# EasyEDA Pro project 可调电源.eprj, schematic 控制板
Board Name: Board2; Create Date: 2025-12-11; Page Name: P1; Project Name: 可调电源; Schematic Name: 控制板; Update Date: 2025-12-27; Company: 嘉立创EDA; Page Size: A4; Version: V1.0
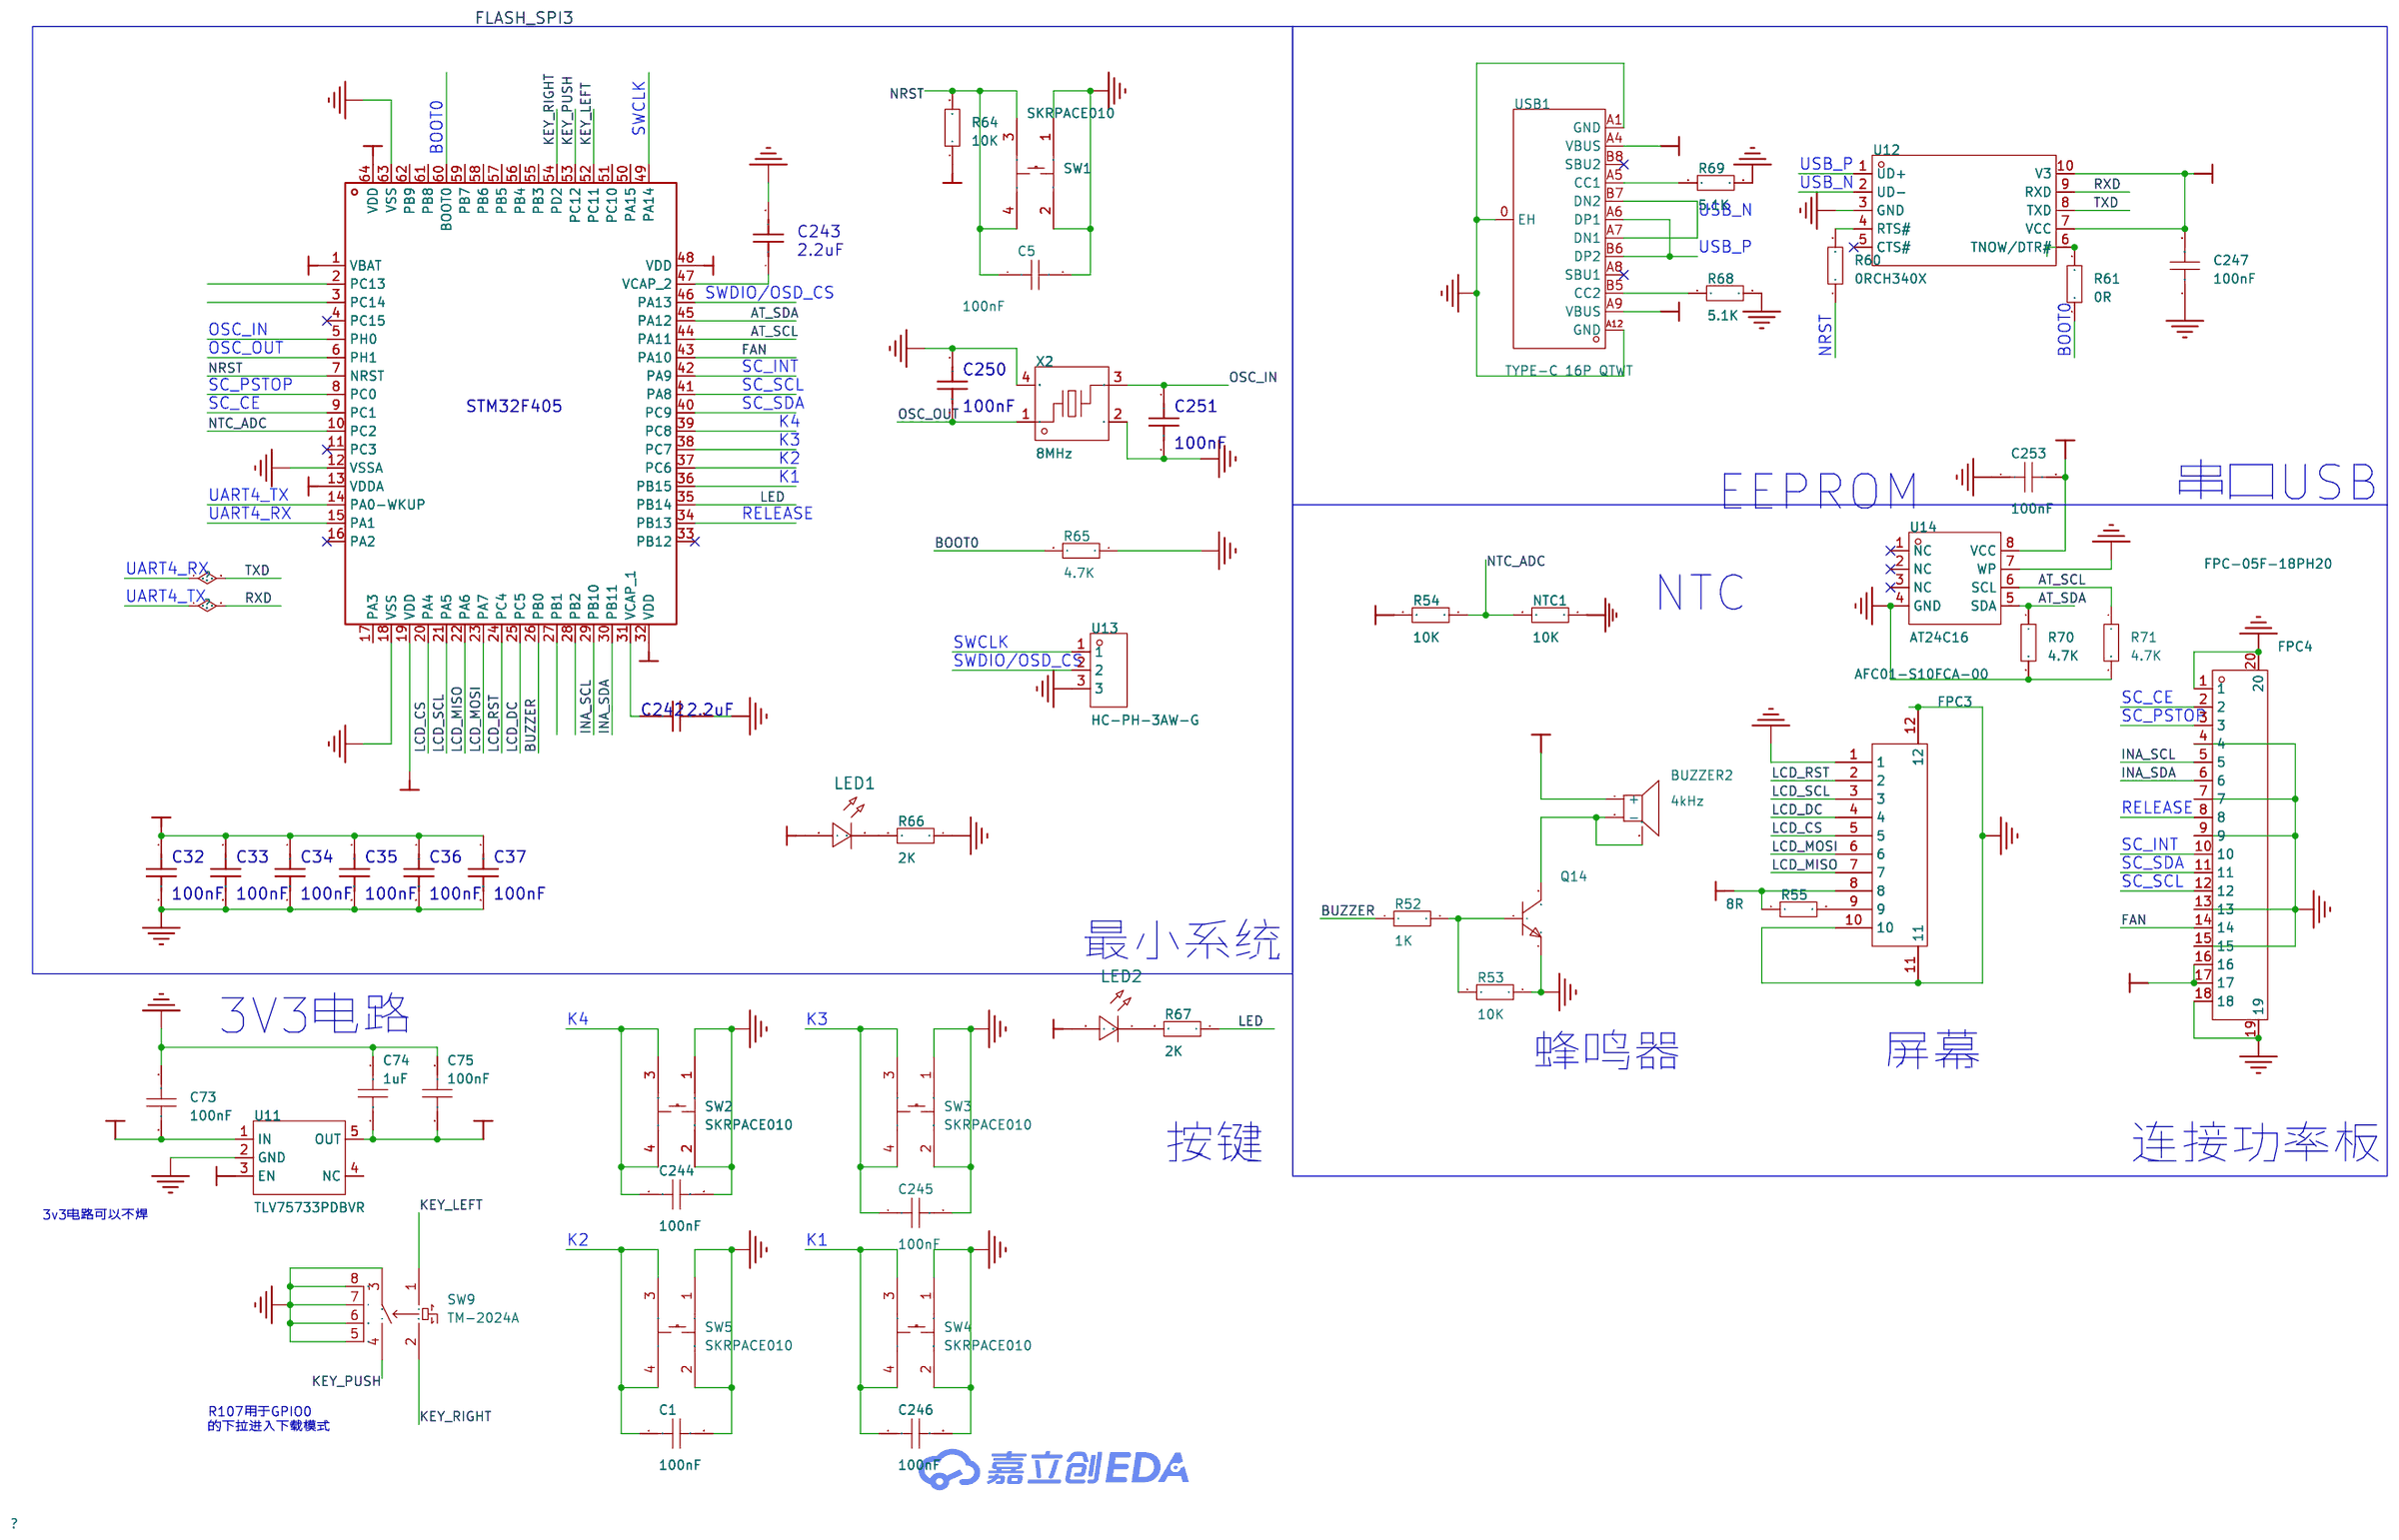
[diagram p1: schematic sheet]

## Parts
BUZZER2  4kHz  [BUZ-SMD_L5.0-W5.5-P4.60]
C1  100nF  [C0603]
C5  100nF  [C0603]
C32  100nF  [C0402]
C33  100nF  [C0402]
C34  100nF  [C0402]
C35  100nF  [C0402]
C36  100nF  [C0402]
C37  100nF  [C0402]
C73  100nF  [C0603]
C74  1uF  [C0603]
C75  100nF  [C0603]
C242  2.2uF  [C0402]
C243  2.2uF  [C0402]
C244  100nF  [C0603]
C245  100nF  [C0603]
C246  100nF  [C0603]
C247  100nF  [C0603]
C250  100nF  [C0402]
C251  100nF  [C0402]
C253  100nF  [C0603]
FPC3  AFC01-S10FCA-00  [FPC-SMD_P0.5-10P_FGS-XJ-H2.0]
FPC4  FPC-05F-18PH20  [FPC-SMD_18P-P0.50_FPC-05F-18PH20]
LED1  -  [LED_0603]
LED2  -  [LED_0603]
NTC1  10K  [R0603]
Q14  -  [S8050_SOT-23]
R52  1K  [R0402]
R53  10K  [R0402]
R54  10K  [R0603]
R55  8R  [R0603]
R60  0R  [R0402]
R61  0R  [R0402]
R64  10K  [R0402]
R65  4.7K  [R0402]
R66  2K  [R0402]
R67  2K  [R0402]
R68  5.1K  [R0402]
R69  5.1K  [R0402]
R70  4.7K  [R0402]
R71  4.7K  [R0402]
STM32F405  STM32F405RGT6V  [LQFP-64_L10.0-W10.0-P0.50-LS12.0-BL]
SW1  SKRPACE010  [KEY-SMD_4P-L4.2-W3.2-P2.20-LS4.6]
SW2  SKRPACE010  [KEY-SMD_4P-L4.2-W3.2-P2.20-LS4.6]
SW3  SKRPACE010  [KEY-SMD_4P-L4.2-W3.2-P2.20-LS4.6]
SW4  SKRPACE010  [KEY-SMD_4P-L4.2-W3.2-P2.20-LS4.6]
SW5  SKRPACE010  [KEY-SMD_4P-L4.2-W3.2-P2.20-LS4.6]
SW9  TM-2024A  [SW-SMD_TM-2024A]
U11  TLV75733PDBVR  [SOT-23-5_L2.9-W1.6-P0.95-LS2.8-BL]
U12  CH340X  [MSOP-10_L3.0-W3.0-P0.50-LS5.0-BL]
U13  HC-PH-3AW-G  [CONN-TH_3P-P2.00_HC-PH-3AW-G]
U14  AT24C16  [SOP-8_L5.0-W4.0-P1.27-LS6.0-BL]
USB1  TYPE-C 16P QTWT  [USB-TYPE-C-SMD_TYPE-C-16P-QTWT]
X2  8MHz  [CRYSTAL-SMD_4P-L3.2-W2.5-BL]

## Library data of the parts
BUZZER2 = MLT-5020: LCSC Part Name: 无源(外部驱动) 电磁式 4kHz; Supplier Part: C94598; Manufacturer: 华能; Supplier Footprint: SMD,5x5mm; JLCPCB Part Class: 扩展库; Datasheet: https://item.szlcsc.com/datasheet/MLT-5020/95796.html; Supplier: LCSC; Driver Circuitry: 无源(外部驱动); Technology: 电磁式; Voltage Rating: 3V; Voltage - Supply: 2V~4V; Current Consumption: 100mA; Sound Pressure Level(SPL): 75dB; Length: 5.2mm; Width: 5.2mm; Height: 2.5mm; Operating Temperature: -20℃~+70℃
C1 C5 C73-C75 C244-C247 C253 = CAP_0603: Supplier Footprint: 0603
C32-C37 C242 C243 C250 C251 = CAP_0402: Supplier Footprint: 0402
FPC3 = AFC01-S10FCA-00: LCSC Part Name: 翻盖式 下接 P数:10P 间距:0.5mm; Supplier Part: C262659; Manufacturer: JS(钜硕电子); Supplier Footprint: SMD,P=0.5mm,卧贴; JLCPCB Part Class: 扩展库; Datasheet: https://item.szlcsc.com/datasheet/AFC01-S10FCA-00/253918.html; Supplier: LCSC; Locking Feature: 翻盖式; Contact Type: 下接; Number of Contacts: 10P; Pitch: 0.5mm; Mounting Type: 卧贴; FFC, FCB Thickness: 0.3mm; Height Above Board: 2mm; Contact Material: 铜合金; Contact Plating: 锡; Operating Temperature: -45℃~+85℃; Rated Voltage (Max): 50V; Current Rating (Max): 500mA
FPC4 = FPC-05F-18PH20: LCSC Part Name: 翻盖式 卧贴 P数:18P 间距:0.5mm; Supplier Part: C2856802; Manufacturer: XUNPU(讯普); Supplier Footprint: SMD,P=0.5mm,卧贴; JLCPCB Part Class: 扩展库; Datasheet: https://item.szlcsc.com/datasheet/FPC-05F-18PH20/3056900.html; Supplier: LCSC; Locking Feature: 翻盖式; Contact Type: 卧贴; Number of Contacts: 18P; Pitch: 0.5mm; Mounting Type: 下接; FFC, FCB Thickness: 0.3mm; Height Above Board: 2mm; Contact Material: 磷青铜; Contact Plating: 锡; Operating Temperature: -25℃~+85℃; Rated Voltage (Max): 50V; Current Rating (Max): 500mA
LED1 LED2 = LED_0603-R: Supplier Footprint: 0603
NTC1 R54 R55 = Res_0603: Supplier Footprint: 0603
Q14 = S8050_SOT_NPN: Supplier Footprint: SOT-23
R52 R53 R60 R61 R64-R71 = Res_0402: Supplier Footprint: 0402
STM32F405 = STM32F405RGT6V: Supplier Part: C1338696; Manufacturer: ST(意法半导体); Supplier Footprint: LQFP-64(10x10); JLCPCB Part Class: Extended Part; Datasheet: https://atta.szlcsc.com/upload/public/pdf/source/20201130/C919362_39400D478C258148B3DF984CE4A4041A.pdf; Supplier: LCSC
SW1-SW5 = SKRPACE010: LCSC Part Name: 4.2*3.2*2.5mm 立贴 轻触开关; Supplier Part: C139797; Manufacturer: ALPSALPINE(阿尔卑斯阿尔派); Supplier Footprint: SMD-4P,4.2x3.2mm; JLCPCB Part Class: 扩展库; Datasheet: https://item.szlcsc.com/datasheet/SKRPACE010/151122.html; Supplier: LCSC; Circuit: 单刀单掷; Actuator Style: 椭圆形按钮; Mounting Type: 立贴; Length: 4.2mm; Width: 3.2mm; Switch Height: 2.5mm; Contact Current: 50mA; Voltage Rating: 16V
SW9 = TM-2024A: 四脚两档拨轮开关TM-2024A; LCSC Part Name: 四脚两档拨轮开关TM-2024A; Supplier Part: C561480; Manufacturer: XKB Connection(中国星坤); Supplier Footprint: SMD; JLCPCB Part Class: 扩展库; Datasheet: https://atta.szlcsc.com/upload/public/pdf/source/20211011/7A4DB3DC37E7D5823B6D92C66ED3191E.pdf; Supplier: LCSC
U11 = TLV75733PDBVR: LCSC Part Name: 具有使能功能的 1A、低 IQ、高精度、低压降稳压器; Supplier Part: C485517; Manufacturer: TI(德州仪器); Supplier Footprint: SOT-23-5; JLCPCB Part Class: 扩展库; Datasheet: https://www.ti.com/cn/lit/gpn/tlv757p; Supplier: LCSC; Output Type: 固定; Voltage - Supply: 5.5V; Output Voltage: 3.3V; Output Current: 1A; Power Supply Rejection Ratio (PSRR): 46dB@(100kHz); Voltage Dropout: 650mV@(1A); standby current: 40uA; Noise: 71.5uVrms; Features: 欠压锁定；软启动；过热保护；过流保护; Operating Temperature: -40℃~+125℃@(Tj); Output Configuration: 正极; Number of Outputs: 1
U12 = CH340X: Supplier Part: C3035748; Manufacturer: WCH(南京沁恒); Supplier Footprint: MSOP-10; JLCPCB Part Class: 扩展库; Datasheet: https://item.szlcsc.com/datasheet/CH340X/3584030.html; Supplier: LCSC; Applications Function: USB转串口；USB转并口; USB Protocol: USB 2.0; Voltage - Supply: 3.3V；5V; Data Rate: 2Mbps; Operating Temperature: -40℃~+85℃
U13 = HC-PH-3AW-G: LCSC Part Name: 1x3P 间距:2mm 弯插 系列:PH; Supplier Part: C5342443; Manufacturer: HCTL(华灿天禄); Supplier Footprint: 弯插,P=2mm; JLCPCB Part Class: 扩展库; Datasheet: https://item.szlcsc.com/datasheet/HC-PH-3AW-G/6118010.html; Supplier: LCSC; Pins Structure: 1x3P; Pitch: 2mm; Mounting Type: 弯插; Reference Series: PH; Number of Pins: 3P; Number of Rows: 1; Number of PINs Per Row: 3; Current Rating: 2A; Contact Material: 黄铜; Contact Plating: 锡; Operating Temperature: -25℃~+85℃; Voltage Rating: 250V; Plastic Material: PA66; Flame Retardant Rating: UL94V-0
U14 = AT24C16_C561263: LCSC Part Name: 16KbitI2C总线电可擦除PROM; Supplier Part: C561263; Manufacturer: IDCHIP(英锐芯); Supplier Footprint: SOP-8; JLCPCB Part Class: 扩展库; Datasheet: https://item.szlcsc.com/datasheet/AT24C16/586593.html; Supplier: LCSC; Interface: I2C; Memory Size: 16Kbit; Clock Frequency: 1MHz; Voltage - Supply: 1.8V~5.5V; Write Cycle Time(Tw): 5ms; Data Retention - TDR (Year): 100年; Write Cycle Endurance: 100万次; Operating Temperature: -40℃~+85℃
USB1 = TYPE-C 16P QTWT: LCSC Part Name: Type-C 母 卧贴; Supplier Part: C5187472; Manufacturer: SHOU HAN(首韩); Supplier Footprint: SMD; JLCPCB Part Class: 扩展库; Datasheet: https://item.szlcsc.com/datasheet/TYPE-C%252016P%2520QTWT/5860367.html; Supplier: LCSC; Connector Type: Type-C; Protocol Standard: USB 3.1; Gender: 母; Mounting Type: 卧贴; Number of Contacts: 16P; Number of Ports: 1; Current Rating-Power: 3A; Voltage Rating: 5V; Connect-Disconnect Life: 5千次; Detection color: 黑色; Operating Temperature: -25℃~+85℃
X2 = X32258MSB4SI: LCSC Part Name: YSX321SL 8MHZ 4P 3225 20PF ±10PPM -40~85℃ (±20PPM); Supplier Part: C2682774; Manufacturer: YXC(扬兴晶振); Supplier Footprint: SMD3225-4P; JLCPCB Part Class: 扩展库; Datasheet: https://item.szlcsc.com/datasheet/X32258MSB4SI/2777871.html; Supplier: LCSC; Type: 贴片晶振; Normal temperature Frequency Tolerance: ±10ppm; Load Capacitance: 20pF; Frequency Stability: ±20ppm; Equivalent Series Resistance(ESR): 120Ω; Operating Temperature: -40℃~+85℃

## Nets
3V3: BUZZER2.1(+) C32.1 C33.1 C34.1 C35.1 C36.1 C37.1 C74.1 C75.1 C247.2 C253.2 FPC3.8 FPC4.16 FPC4.17 LED1.2(A) LED2.2(A) R54.2 R55.1 R64.1 STM32F405.1(VBAT) STM32F405.13(VDDA) STM32F405.19(VDD) STM32F405.32(VDD) STM32F405.48(VDD) STM32F405.64(VDD) U11.5(OUT) U12.7(VCC) U12.10(V3) U14.8(VCC)
+5V: C73.1 U11.1(IN) U11.3(EN) USB1.A4(VBUS) USB1.A9(VBUS)
GND: C1.2 C5.2 C32.2 C33.2 C34.2 C35.2 C36.2 C37.2 C73.2 C74.2 C75.2 C242.2 C243.2 C244.2 C245.2 C246.2 C247.1 C250.1 C251.2 C253.1 FPC3.1 FPC3.10 FPC3.11 FPC3.12 FPC4.1 FPC4.4 FPC4.7 FPC4.9 FPC4.13 FPC4.15 FPC4.18 FPC4.19 FPC4.20 NTC1.1 Q14.2 R53.1 R65.1 R66.1 R68.1 R69.1 R70.2 R71.2 STM32F405.12(VSSA) STM32F405.18(VSS) STM32F405.63(VSS) SW1.1 SW1.2 SW2.1 SW2.2 SW3.1 SW3.2 SW4.1 SW4.2 SW5.1 SW5.2 SW9.3 SW9.5 SW9.6 SW9.7 SW9.8 U11.2(GND) U12.3(GND) U13.3 U14.4(GND) U14.7(WP) USB1.0(EH) USB1.A1(GND) USB1.A12(GND) X2.2(GND) X2.4(GND)
AT_SCL: R71.1 STM32F405.44(PA11) U14.6(SCL)
AT_SDA: R70.1 STM32F405.45(PA12) U14.5(SDA)
BOOT0: R61.1 R65.2 STM32F405.60(BOOT0)
BUZZER: R52.1 STM32F405.26(PB0)
FAN: FPC4.14 STM32F405.43(PA10)
INA_SCL: FPC4.5 STM32F405.29(PB10)
INA_SDA: FPC4.6 STM32F405.30(PB11)
K1: C246.1 STM32F405.36(PB15) SW4.3 SW4.4
K2: C1.1 STM32F405.37(PC6) SW5.3 SW5.4
K3: C245.1 STM32F405.38(PC7) SW3.3 SW3.4
K4: C244.1 STM32F405.39(PC8) SW2.3 SW2.4
KEY_LEFT: STM32F405.52(PC11) SW9.1
KEY_PUSH: STM32F405.53(PC12) SW9.4
KEY_RIGHT: STM32F405.54(PD2) SW9.2
LCD_CS: FPC3.5 STM32F405.20(PA4)
LCD_DC: FPC3.4 STM32F405.25(PC5)
LCD_MISO: FPC3.7 STM32F405.22(PA6)
LCD_MOSI: FPC3.6 STM32F405.23(PA7)
LCD_RST: FPC3.2 STM32F405.24(PC4)
LCD_SCL: FPC3.3 STM32F405.21(PA5)
LED: R67.1 STM32F405.35(PB14)
NRST: C5.1 R60.1 R64.2 STM32F405.7(NRST) SW1.3 SW1.4
NTC_ADC: NTC1.2 R54.1 STM32F405.10(PC2)
OSC_IN: C251.1 STM32F405.5(PH0) X2.3
OSC_OUT: C250.2 STM32F405.6(PH1) X2.1
RELEASE: FPC4.8 STM32F405.34(PB13)
RXD: STM32F405.14(PA0-WKUP) U12.9(RXD)
SC_CE: FPC4.2 STM32F405.9(PC1)
SC_INT: FPC4.10 STM32F405.42(PA9)
SC_PSTOP: FPC4.3 STM32F405.8(PC0)
SC_SCL: FPC4.12 STM32F405.41(PA8)
SC_SDA: FPC4.11 STM32F405.40(PC9)
SWCLK: STM32F405.49(PA14) U13.1
SWDIO/OSD_CS: STM32F405.46(PA13) U13.2
TXD: STM32F405.15(PA1) U12.8(TXD)
USB_N: U12.2(UD-) USB1.A7(DN1) USB1.B7(DN2)
USB_P: U12.1(UD+) USB1.A6(DP1) USB1.B6(DP2)
$1N1881: Q14.1 R52.2 R53.2
$1N1887: BUZZER2.2(-) BUZZER2.3(NC) Q14.3
$1N4544: C242.1 STM32F405.31(VCAP_1)
$1N4570: C243.1 STM32F405.47(VCAP_2)
$1N6033: FPC3.9 R55.2
$1N7364: R60.2 U12.4(RTS#)
$1N7403: R61.2 U12.6(TNOW/DTR#)
$1N10061: LED1.1(C) R66.2
$1N10137: LED2.1(C) R67.2
$1N15960: R68.2 USB1.B5(CC2)
$1N15986: R69.2 USB1.A5(CC1)

Not connected (* = marked no-connect by the designer): STM32F405 2(PC13) 3(PC14) 4(PC15)* 11(PC3)* 16(PA2)* 17(PA3) 27(PB1) 28(PB2) 33(PB12)* 50(PA15) 51(PC10) 55(PB3) 56(PB4) 57(PB5) 58(PB6) 59(PB7) 61(PB8) 62(PB9); U11 4(NC); U12 5(CTS#)*; U14 1(NC)* 2(NC)* 3(NC)*; USB1 A8(SBU1)* B8(SBU2)*

## Notes on the sheet
- FLASH_SPI3
- EEPROM
- 串口USB
- NTC
- 最小系统
- 3V3电路
- 蜂鸣器
- 屏幕
- 按键
- 连接功率板
- 3v3电路可以不焊
- R107用于GPIO0
  的下拉进入下载模式
